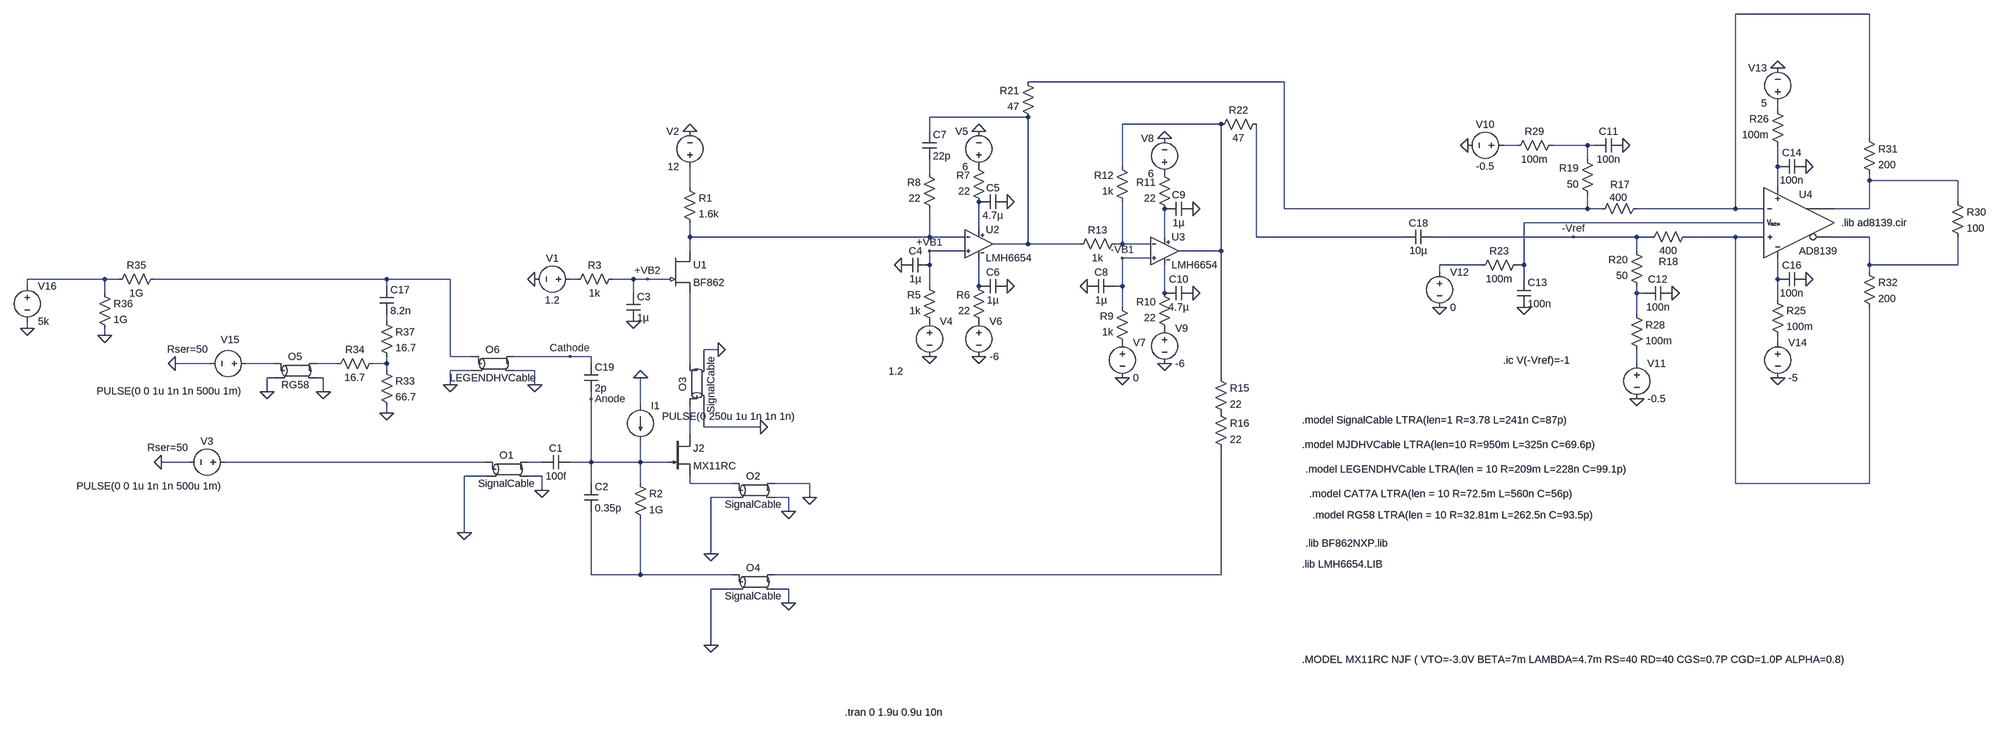
[diagram p0: schematic PulseCouplingModel.asc]
PulseCouplingModel.asc, the LTspice schematic file:
Version 4
SHEET 1 3652 856
WIRE 3040 -960 2736 -960
WIRE 1712 -704 992 -704
WIRE 2832 -640 2832 -656
WIRE 992 -624 768 -624
WIRE 1568 -608 1344 -608
WIRE 768 -592 768 -624
WIRE 3040 -576 3040 -960
WIRE 2240 -560 2208 -560
WIRE 2400 -560 2320 -560
WIRE 2416 -560 2400 -560
WIRE 2400 -528 2400 -560
WIRE 1344 -512 1344 -608
WIRE 2832 -512 2832 -560
WIRE 768 -496 768 -528
WIRE 3040 -480 3040 -496
WIRE 3424 -480 3040 -480
WIRE 224 -464 224 -512
WIRE 2832 -464 2832 -512
WIRE 3424 -432 3424 -480
WIRE 1712 -416 1712 -704
WIRE 2400 -416 2400 -448
WIRE 2400 -416 1712 -416
WIRE 2432 -416 2400 -416
WIRE 2736 -416 2736 -960
WIRE 2736 -416 2512 -416
WIRE 2800 -416 2736 -416
WIRE 3040 -416 3040 -480
WIRE 3040 -416 2960 -416
WIRE 2800 -384 2256 -384
WIRE 880 -368 880 -432
WIRE 224 -352 224 -384
WIRE 768 -352 768 -416
WIRE 768 -352 224 -352
WIRE 848 -352 768 -352
WIRE 1440 -352 1440 -416
WIRE 1648 -352 1648 -608
WIRE 1984 -352 1648 -352
WIRE 2368 -352 2048 -352
WIRE 2512 -352 2368 -352
WIRE 2544 -352 2512 -352
WIRE 2736 -352 2624 -352
WIRE 2800 -352 2736 -352
WIRE 3040 -352 2960 -352
WIRE 992 -336 992 -624
WIRE 992 -336 912 -336
WIRE 1248 -336 992 -336
WIRE 1344 -336 1344 -432
WIRE 1344 -336 1328 -336
WIRE 1408 -336 1344 -336
WIRE 224 -320 224 -352
WIRE 848 -320 768 -320
WIRE 1568 -320 1568 -608
WIRE 1568 -320 1472 -320
WIRE 2512 -320 2512 -352
WIRE 1408 -304 1344 -304
WIRE 768 -288 768 -320
WIRE 2160 -288 2064 -288
WIRE 2256 -288 2256 -384
WIRE 2256 -288 2240 -288
WIRE 3040 -288 3040 -352
WIRE 3424 -288 3424 -352
WIRE 3424 -288 3040 -288
WIRE 2064 -272 2064 -288
WIRE 3040 -272 3040 -288
WIRE -1104 -256 -1280 -256
WIRE -1072 -256 -1104 -256
WIRE -464 -256 -992 -256
WIRE -320 -256 -464 -256
WIRE -32 -256 -48 -256
WIRE 96 -256 48 -256
WIRE 128 -256 96 -256
WIRE 176 -256 128 -256
WIRE 2256 -256 2256 -288
WIRE 2832 -256 2832 -304
WIRE -1280 -240 -1280 -256
WIRE -464 -240 -464 -256
WIRE 768 -240 768 -288
WIRE 880 -240 880 -304
WIRE 1344 -240 1344 -304
WIRE 1344 -240 1328 -240
WIRE -1104 -224 -1104 -256
WIRE 96 -224 96 -256
WIRE 1440 -224 1440 -288
WIRE 2512 -224 2512 -240
WIRE 2528 -224 2512 -224
WIRE 2832 -208 2832 -256
WIRE 1344 -192 1344 -240
WIRE 2512 -176 2512 -224
WIRE -464 -160 -464 -176
WIRE -1280 -144 -1280 -160
WIRE -1104 -128 -1104 -144
WIRE 2832 -112 2832 -128
WIRE 288 -96 256 -96
WIRE -320 -80 -320 -256
WIRE -272 -80 -320 -80
WIRE -48 -80 -176 -80
WIRE 0 -80 -48 -80
WIRE -864 -64 -944 -64
WIRE -720 -64 -784 -64
WIRE -576 -64 -624 -64
WIRE -464 -64 -464 -80
WIRE -464 -64 -496 -64
WIRE 0 -64 0 -80
WIRE 224 -64 224 -224
WIRE 256 -64 256 -96
WIRE 2512 -64 2512 -96
WIRE -464 -48 -464 -64
WIRE -272 -48 -320 -48
WIRE -128 -48 -176 -48
WIRE -720 -32 -736 -32
WIRE -608 -32 -624 -32
WIRE 1568 -32 1568 -320
WIRE -320 -16 -320 -48
WIRE -128 -16 -128 -48
WIRE -736 0 -736 -32
WIRE -608 0 -608 -32
WIRE 0 16 0 0
WIRE 112 32 112 -32
WIRE -464 48 -464 32
WIRE 256 80 256 32
WIRE 384 80 256 80
WIRE 224 96 224 32
WIRE -912 160 -976 160
WIRE -240 160 -832 160
WIRE -112 160 -144 160
WIRE 0 160 0 16
WIRE 0 160 -48 160
WIRE 112 160 112 112
WIRE 112 160 0 160
WIRE 176 160 112 160
WIRE -240 192 -288 192
WIRE -112 192 -144 192
WIRE 0 208 0 160
WIRE 112 208 112 160
WIRE 224 208 224 192
WIRE 320 208 224 208
WIRE 496 208 416 208
WIRE 2736 208 2736 -352
WIRE 3040 208 3040 -192
WIRE 3040 208 2736 208
WIRE -112 224 -112 192
WIRE 320 240 272 240
WIRE 448 240 416 240
WIRE 496 240 496 208
WIRE 448 272 448 240
WIRE -288 320 -288 192
WIRE 272 368 272 240
WIRE 0 416 0 272
WIRE 112 416 112 288
WIRE 112 416 0 416
WIRE 320 416 112 416
WIRE 1568 416 1568 128
WIRE 1568 416 416 416
WIRE 320 448 272 448
WIRE 448 448 416 448
WIRE 448 480 448 448
WIRE 272 576 272 448
FLAG -128 -256 0
FLAG 224 -592 0
FLAG -976 160 0
FLAG 96 -160 0
FLAG 944 -432 0
FLAG 944 -240 0
FLAG 704 -288 0
FLAG 880 -592 0
FLAG 880 -80 0
FLAG 768 -80 0
FLAG 1504 -416 0
FLAG 1504 -224 0
FLAG 1264 -240 0
FLAG 1440 -576 0
FLAG 1440 -64 0
FLAG 1344 -32 0
FLAG 2480 -560 0
FLAG 2592 -224 0
FLAG 2256 -192 0
FLAG 2064 -192 0
FLAG 2128 -560 0
FLAG 2512 16 0
FLAG 2896 -256 0
FLAG 2896 -512 0
FLAG 2832 -736 0
FLAG 2832 -32 0
FLAG 768 -320 +VB1
FLAG 1344 -304 -VB1
FLAG 128 -256 +VB2
FLAG 2368 -352 -Vref
FLAG -112 224 0
FLAG -288 320 0
FLAG 448 272 0
FLAG 272 368 0
FLAG 288 -96 0
FLAG 384 80 0
FLAG 496 240 0
FLAG 448 480 0
FLAG 272 576 0
FLAG -944 -64 0
FLAG -608 0 0
FLAG -736 0 0
FLAG -464 48 0
FLAG -1280 -144 0
FLAG -1104 -128 0
FLAG -128 -16 0
FLAG -320 -16 0
FLAG -48 -80 Cathode
FLAG 0 16 Anode
FLAG 112 -32 0
SYMBOL voltage -32 -256 R90
WINDOW 0 -32 56 VBottom 2
WINDOW 3 32 56 VTop 2
SYMATTR InstName V1
SYMATTR Value 1.2
SYMBOL res 208 -480 R0
SYMATTR InstName R1
SYMATTR Value 1.6k
SYMBOL voltage 224 -496 R180
WINDOW 0 24 96 Left 2
WINDOW 3 24 16 Left 2
SYMATTR InstName V2
SYMATTR Value 12
SYMBOL cap -48 144 R90
WINDOW 0 0 32 VBottom 2
WINDOW 3 32 32 VTop 2
SYMATTR InstName C1
SYMATTR Value 100f
SYMBOL cap -16 208 R0
SYMATTR InstName C2
SYMATTR Value 0.35p
SYMBOL res 96 192 R0
SYMATTR InstName R2
SYMATTR Value 1G
SYMBOL res 64 -272 R90
WINDOW 0 0 56 VBottom 2
WINDOW 3 32 56 VTop 2
SYMATTR InstName R3
SYMATTR Value 1k
SYMBOL cap 80 -224 R0
SYMATTR InstName C3
SYMATTR Value 1µ
SYMBOL cap 768 -304 R90
WINDOW 0 0 32 VBottom 2
WINDOW 3 32 32 VTop 2
SYMATTR InstName C4
SYMATTR Value 1µ
SYMBOL cap 944 -448 R90
WINDOW 0 0 32 VBottom 2
WINDOW 3 32 32 VTop 2
SYMATTR InstName C5
SYMATTR Value 4.7µ
SYMBOL cap 944 -256 R90
WINDOW 0 0 32 VBottom 2
WINDOW 3 32 32 VTop 2
SYMATTR InstName C6
SYMATTR Value 1µ
SYMBOL res 784 -144 R180
WINDOW 0 36 76 Left 2
WINDOW 3 36 40 Left 2
SYMATTR InstName R5
SYMATTR Value 1k
SYMBOL res 896 -144 R180
WINDOW 0 36 76 Left 2
WINDOW 3 36 40 Left 2
SYMATTR InstName R6
SYMATTR Value 22
SYMBOL res 896 -416 R180
WINDOW 0 36 76 Left 2
WINDOW 3 36 40 Left 2
SYMATTR InstName R7
SYMATTR Value 22
SYMBOL res 784 -400 R180
WINDOW 0 36 76 Left 2
WINDOW 3 36 40 Left 2
SYMATTR InstName R8
SYMATTR Value 22
SYMBOL voltage 768 -176 R0
WINDOW 3 -93 129 Left 2
SYMATTR Value 1.2
SYMATTR InstName V4
SYMBOL voltage 880 -496 R180
WINDOW 0 24 96 Left 2
WINDOW 3 24 16 Left 2
WINDOW 123 0 0 Left 0
WINDOW 39 0 0 Left 0
SYMATTR InstName V5
SYMATTR Value 6
SYMBOL voltage 880 -176 R0
SYMATTR InstName V6
SYMATTR Value -6
SYMBOL cap 1328 -256 R90
WINDOW 0 0 32 VBottom 2
WINDOW 3 32 32 VTop 2
SYMATTR InstName C8
SYMATTR Value 1µ
SYMBOL cap 1504 -432 R90
WINDOW 0 0 32 VBottom 2
WINDOW 3 32 32 VTop 2
SYMATTR InstName C9
SYMATTR Value 1µ
SYMBOL cap 1504 -240 R90
WINDOW 0 0 32 VBottom 2
WINDOW 3 32 32 VTop 2
SYMATTR InstName C10
SYMATTR Value 4.7µ
SYMBOL res 1360 -96 R180
WINDOW 0 36 76 Left 2
WINDOW 3 36 40 Left 2
SYMATTR InstName R9
SYMATTR Value 1k
SYMBOL res 1456 -128 R180
WINDOW 0 36 76 Left 2
WINDOW 3 36 40 Left 2
SYMATTR InstName R10
SYMATTR Value 22
SYMBOL res 1456 -400 R180
WINDOW 0 36 76 Left 2
WINDOW 3 36 40 Left 2
SYMATTR InstName R11
SYMATTR Value 22
SYMBOL res 1360 -416 R180
WINDOW 0 36 76 Left 2
WINDOW 3 36 40 Left 2
SYMATTR InstName R12
SYMATTR Value 1k
SYMBOL voltage 1344 -128 R0
SYMATTR InstName V7
SYMATTR Value 0
SYMBOL voltage 1440 -480 R180
WINDOW 0 24 96 Left 2
WINDOW 3 24 16 Left 2
WINDOW 123 0 0 Left 0
WINDOW 39 0 0 Left 0
SYMATTR InstName V8
SYMATTR Value 6
SYMBOL voltage 1440 -160 R0
SYMATTR InstName V9
SYMATTR Value -6
SYMBOL res 1344 -352 R90
WINDOW 0 0 56 VBottom 2
WINDOW 3 32 56 VTop 2
SYMATTR InstName R13
SYMATTR Value 1k
SYMBOL res 1552 -48 R0
SYMATTR InstName R15
SYMATTR Value 22
SYMBOL res 1552 32 R0
SYMATTR InstName R16
SYMATTR Value 22
SYMBOL cap 752 -592 R0
SYMATTR InstName C7
SYMATTR Value 22p
SYMBOL AutoGenerated\\AD8139 2864 -384 R0
SYMATTR InstName U4
SYMBOL res 2528 -432 R90
WINDOW 0 -23 54 VBottom 2
WINDOW 3 -25 58 VTop 2
SYMATTR InstName R17
SYMATTR Value 400
SYMBOL res 2640 -368 R90
WINDOW 0 88 56 VBottom 2
WINDOW 3 32 56 VTop 2
SYMATTR InstName R18
SYMATTR Value 400
SYMBOL res 2416 -432 R180
WINDOW 0 36 76 Left 2
WINDOW 3 36 40 Left 2
SYMATTR InstName R19
SYMATTR Value 50
SYMBOL res 2528 -224 R180
WINDOW 0 36 76 Left 2
WINDOW 3 36 40 Left 2
SYMATTR InstName R20
SYMATTR Value 50
SYMBOL cap 2480 -576 R90
WINDOW 0 0 32 VBottom 2
WINDOW 3 32 32 VTop 2
SYMATTR InstName C11
SYMATTR Value 100n
SYMBOL cap 2592 -240 R90
WINDOW 0 0 32 VBottom 2
WINDOW 3 32 32 VTop 2
SYMATTR InstName C12
SYMATTR Value 100n
SYMBOL voltage 2224 -560 R90
WINDOW 0 -32 56 VBottom 2
WINDOW 3 32 56 VTop 2
SYMATTR InstName V10
SYMATTR Value -0.5
SYMBOL voltage 2512 -80 R0
SYMATTR InstName V11
SYMATTR Value -0.5
SYMBOL voltage 2064 -288 R0
SYMATTR InstName V12
SYMATTR Value 0
SYMBOL cap 2240 -256 R0
SYMATTR InstName C13
SYMATTR Value 100n
SYMBOL res 1008 -608 R180
WINDOW 0 36 76 Left 2
WINDOW 3 36 40 Left 2
SYMATTR InstName R21
SYMATTR Value 47
SYMBOL res 1664 -624 R90
WINDOW 0 0 56 VBottom 2
WINDOW 3 32 56 VTop 2
SYMATTR InstName R22
SYMATTR Value 47
SYMBOL res 2256 -304 R90
WINDOW 0 0 56 VBottom 2
WINDOW 3 32 56 VTop 2
SYMATTR InstName R23
SYMATTR Value 100m
SYMBOL cap 2896 -528 R90
WINDOW 0 0 32 VBottom 2
WINDOW 3 32 32 VTop 2
SYMATTR InstName C14
SYMATTR Value 100n
SYMBOL res 2816 -224 R0
SYMATTR InstName R25
SYMATTR Value 100m
SYMBOL cap 2896 -272 R90
WINDOW 0 0 32 VBottom 2
WINDOW 3 32 32 VTop 2
SYMATTR InstName C16
SYMATTR Value 100n
SYMBOL voltage 2832 -640 R180
WINDOW 0 24 96 Left 2
WINDOW 3 24 16 Left 2
SYMATTR InstName V13
SYMATTR Value 5
SYMBOL res 2848 -544 R180
WINDOW 0 36 76 Left 2
WINDOW 3 36 40 Left 2
SYMATTR InstName R26
SYMATTR Value 100m
SYMBOL res 2496 -192 R0
SYMATTR InstName R28
SYMATTR Value 100m
SYMBOL res 2336 -576 R90
WINDOW 0 0 56 VBottom 2
WINDOW 3 32 56 VTop 2
SYMATTR InstName R29
SYMATTR Value 100m
SYMBOL voltage 2832 -128 R0
SYMATTR InstName V14
SYMATTR Value -5
SYMBOL res 3408 -448 R0
SYMATTR InstName R30
SYMATTR Value 100
SYMBOL cap 2048 -368 R90
WINDOW 0 0 32 VBottom 2
WINDOW 3 32 32 VTop 2
SYMATTR InstName C18
SYMATTR Value 10µ
SYMBOL res 3024 -592 R0
SYMATTR InstName R31
SYMATTR Value 200
SYMBOL res 3024 -288 R0
SYMATTR InstName R32
SYMATTR Value 200
SYMBOL voltage -816 160 R90
WINDOW 0 -32 56 VBottom 2
WINDOW 3 39 187 VTop 2
WINDOW 123 0 0 Left 0
WINDOW 39 -49 145 VTop 2
SYMATTR InstName V3
SYMATTR Value PULSE(0 0 1u 1n 1n 500u 1m)
SYMATTR SpiceLine Rser=50
SYMBOL njf 176 96 R0
SYMATTR InstName J2
SYMATTR Value MX11RC
SYMBOL AutoGenerated\\BF862 176 -320 R0
SYMATTR InstName U1
SYMBOL AutoGenerated\\LMH6654 880 -400 R0
SYMATTR InstName U2
SYMBOL AutoGenerated\\LMH6654 1440 -384 R0
SYMATTR InstName U3
SYMBOL ltline -192 176 R0
SYMATTR InstName O1
SYMATTR Value SignalCable
SYMBOL ltline 240 -16 R270
SYMATTR InstName O3
SYMATTR Value SignalCable
SYMBOL ltline 368 224 R0
SYMATTR InstName O2
SYMATTR Value SignalCable
SYMBOL ltline 368 432 R0
SYMATTR InstName O4
SYMATTR Value SignalCable
SYMBOL voltage -768 -64 R90
WINDOW 0 -70 51 VTop 2
WINDOW 3 78 189 VBottom 2
WINDOW 123 0 0 Left 0
WINDOW 39 -48 148 VTop 2
SYMATTR InstName V15
SYMATTR Value PULSE(0 0 1u 1n 1n 500u 1m)
SYMATTR SpiceLine Rser=50
SYMBOL cap -480 -240 R0
SYMATTR InstName C17
SYMATTR Value 8.2n
SYMBOL res -480 -64 R0
SYMATTR InstName R33
SYMATTR Value 66.7
SYMBOL res -480 -80 R90
WINDOW 0 0 56 VBottom 2
WINDOW 3 32 56 VTop 2
SYMATTR InstName R34
SYMATTR Value 16.7
SYMBOL ltline -672 -48 R0
SYMATTR InstName O5
SYMATTR Value RG58
SYMBOL res -1088 -240 R270
WINDOW 0 32 56 VTop 2
WINDOW 3 0 56 VBottom 2
SYMATTR InstName R35
SYMATTR Value 1G
SYMBOL res -1120 -240 R0
SYMATTR InstName R36
SYMATTR Value 1G
SYMBOL voltage -1280 -256 R0
SYMATTR InstName V16
SYMATTR Value 5k
SYMBOL res -480 -176 R0
SYMATTR InstName R37
SYMATTR Value 16.7
SYMBOL cap -16 -64 R0
SYMATTR InstName C19
SYMATTR Value 2p
SYMBOL ltline -224 -64 R0
SYMATTR InstName O6
SYMATTR Value LEGENDHVCable
SYMBOL current 112 32 R0
WINDOW 3 49 24 Left 2
WINDOW 123 0 0 Left 0
WINDOW 39 0 0 Left 0
SYMATTR Value PULSE(0 250u 1u 1n 1n 1n)
SYMATTR InstName I1
TEXT 576 728 Left 2 !.tran 0 1.9u 0.9u 10n
TEXT 1752 608 Left 2 !.MODEL MX11RC NJF ( VTO=-3.0V BETA=7m LAMBDA=4.7m RS=40 RD=40 CGS=0.7P CGD=1.0P ALPHA=0.8)
TEXT 1760 344 Left 2 !.lib BF862NXP.lib
TEXT 1752 64 Left 2 !.model SignalCable LTRA(len=1 R=3.78 L=241n C=87p)
TEXT 1752 392 Left 2 !.lib LMH6654.LIB
TEXT 2976 -384 Left 2 !.lib ad8139.cir
TEXT 1752 120 Left 2 !.model MJDHVCable LTRA(len=10 R=950m L=325n C=69.6p)
TEXT 1760 176 Left 2 !.model LEGENDHVCable LTRA(len = 10 R=209m L=228n C=99.1p)
TEXT 1768 232 Left 2 !.model CAT7A LTRA(len = 10 R=72.5m L=560n C=56p)
TEXT 2208 -72 Left 2 !.ic V(-Vref)=-1
TEXT 1776 280 Left 2 !.model RG58 LTRA(len = 10 R=32.81m L=262.5n C=93.5p)

The netlist it stands for:
* PulseCouplingModel.asc
V1 N023 0 1.2
R1 N011 N014 1.6k
V2 N011 0 12
C1 Anode N037 100f
C2 Anode N039 0.35p
R2 Anode N039 1G
R3 +VB2 N023 1k
C3 +VB2 0 1µ
C4 +VB1 0 1µ
C5 0 N013 4.7µ
C6 0 N025 1µ
R5 P001 +VB1 1k
R6 P002 N025 22
R7 N013 P003 22
R8 N014 N009 22
V4 P001 0 1.2
V5 P003 0 6
V6 P002 0 -6
C8 -VB1 0 1µ
C9 0 N015 1µ
C10 0 N026 4.7µ
R9 P004 -VB1 1k
R10 P005 N026 22
R11 N015 P006 22
R12 N019 N005 1k
V7 P004 0 0
V8 P006 0 6
V9 P005 0 -6
R13 N019 N004 1k
R15 N005 P007 22
R16 P007 N040 22
C7 N004 N009 22p
XU4 N001 N012 N008 N010 N018 N024 N017 AD8139  ; pins IN- VOCM V+ OUT+ OUT- V- IN+
R17 N001 N002 400
R18 N017 -Vref 400
R19 N002 N007 50
R20 N027 -Vref 50
C11 0 N007 100n
C12 0 N027 100n
V10 N006 0 -0.5
V11 N034 0 -0.5
V12 N020 0 0
C13 N012 0 100n
R21 N004 N002 47
R22 N016 N005 47
R23 N012 N020 100m
C14 0 N008 100n
R25 N024 N029 100m
C16 0 N024 100n
V13 N003 0 5
R26 N008 N003 100m
R28 N027 N034 100m
R29 N007 N006 100m
V14 N029 0 -5
R30 N010 N018 100
C18 -Vref N016 10µ
R31 N001 N010 200
R32 N018 N017 200
V3 N036 0 PULSE(0 0 1u 1n 1n 500u 1m) Rser=50
J2 N035 Anode N038 MX11RC
XU1 N014 +VB2 N033 BF862  ; pins D G S
XU2 N014 +VB1 N013 N025 N004 LMH6654  ; pins -IN +IN VCC VEE OUT
XU3 N019 -VB1 N015 N026 N005 LMH6654  ; pins -IN +IN VCC VEE OUT
O1 N036 0 N037 0 SignalCable
O3 N035 0 N033 0 SignalCable
O2 N038 0 0 0 SignalCable
O4 N039 0 N040 0 SignalCable
V15 N030 0 PULSE(0 0 1u 1n 1n 500u 1m) Rser=50
C17 N022 N028 8.2n
R33 N032 0 66.7
R34 N032 N031 16.7
O5 N030 0 N031 0 RG58
R35 N021 N022 1G
R36 N021 0 1G
V16 N021 0 5k
R37 N028 N032 16.7
C19 Cathode Anode 2p
O6 N022 0 Cathode 0 LEGENDHVCable
I1 0 Anode PULSE(0 250u 1u 1n 1n 1n)
.model NJF NJF
.model PJF PJF
.lib standard.jft
.tran 0 1.9u 0.9u 10n
.MODEL MX11RC NJF ( VTO=-3.0V BETA=7m LAMBDA=4.7m RS=40 RD=40 CGS=0.7P CGD=1.0P ALPHA=0.8)
.lib BF862NXP.lib
.model SignalCable LTRA(len=1 R=3.78 L=241n C=87p)
.lib LMH6654.LIB
.lib ad8139.cir
.model MJDHVCable LTRA(len=10 R=950m L=325n C=69.6p)
.model LEGENDHVCable LTRA(len = 10 R=209m L=228n C=99.1p)
.model CAT7A LTRA(len = 10 R=72.5m L=560n C=56p)
.ic V(-Vref)=-1
.model RG58 LTRA(len = 10 R=32.81m L=262.5n C=93.5p)
.backanno
.end